# EAGLE design BMP388-Breakout_v10 (EAGLE 7.7.0)
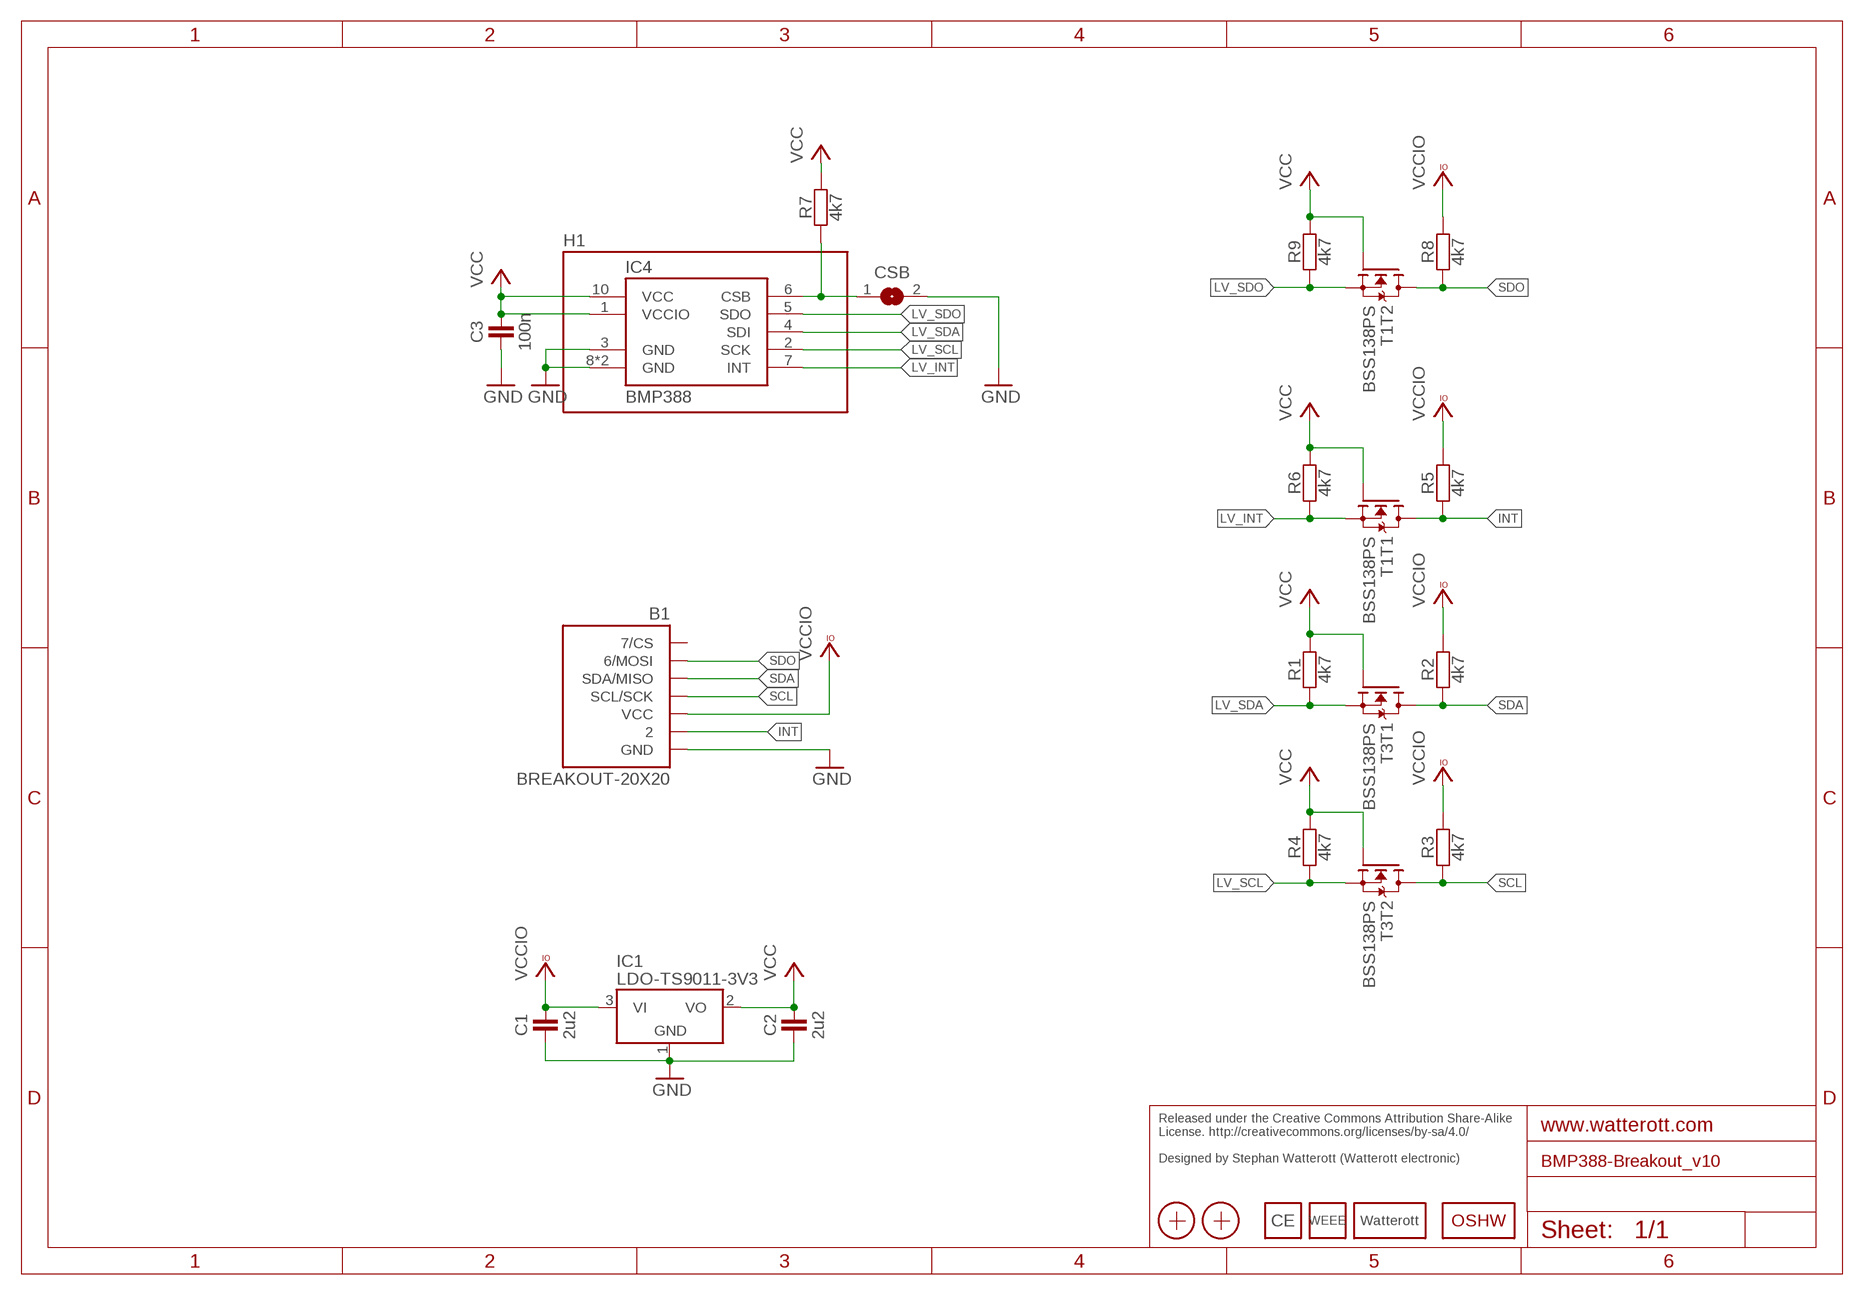
[diagram p0: schematic, sheet 1]

## Parts
B1  BREAKOUT-20X20  [BREAKOUT-20X20]
C1  2u2  CAPACITOR-0402  [C0402]
C2  2u2  CAPACITOR-0402  [C0402]
C3  100n  CAPACITOR-0402  [C0402]
CSB  JUMPER2-0603-NC  [JUMPER2-0603_NC]
H1  SF2  [SF2]
IC1  LDO-TS9011-3V3  [SOT23]
IC4  BMP388  [BMP388]
LOGO2  OSHW_LOGOX0070  [OSHW_6X70]
LOGO3  LOGO_WEEE-4  [WEEE_4MM]
LOGO4  LOGO_CE-4  [CE_4MM]
LOGO5  LOGO_SPARK-4  [SPARK_4MM]
R1  4k7  RESISTOR-0402  [C0402]
R2  4k7  RESISTOR-0402  [C0402]
R3  4k7  RESISTOR-0402  [C0402]
R4  4k7  RESISTOR-0402  [C0402]
R5  4k7  RESISTOR-0402  [C0402]
R6  4k7  RESISTOR-0402  [C0402]
R7  4k7  RESISTOR-0402  [C0402]
R8  4k7  RESISTOR-0402  [C0402]
R9  4k7  RESISTOR-0402  [C0402]
T1  BSS138PS  [SOT363]
T3  BSS138PS  [SOT363]
X1  PASSER-07  [PASSER_07MM]
X2  PASSER-07  [PASSER_07MM]

## Nets
GND: B1.GND C1.1 C2.1 C3.1 CSB.2 IC1.1(GND) IC4.3(GND) IC4.8(GND) IC4.9(GND)
INT: B1.2 R5.1 T1.6(T1:D)
LV_INT: IC4.7(INT) R6.1 T1.1(T1:S)
LV_SCL: IC4.2(SCK) R4.1 T3.4(T2:S)
LV_SDA: IC4.4(SDI) R1.1 T3.1(T1:S)
LV_SDO: IC4.5(SDO) R9.1 T1.4(T2:S)
N$1: CSB.1 IC4.6(CSB) R7.1
SCL: B1.SCL/SCK R3.1 T3.3(T2:D)
SDA: B1.SDA/MISO R2.1 T3.6(T1:D)
SDO: B1.MOSI(6/MOSI) R8.1 T1.3(T2:D)
VCC: C2.2 C3.2 IC1.2(VO) IC4.1(VCCIO) IC4.10(VCC) R1.2 R4.2 R6.2 R7.2 R9.2 T1.2(T1:G) T1.5(T2:G) T3.2(T1:G) T3.5(T2:G)
VCCIO: B1.VCC C1.2 IC1.3(VI) R2.2 R3.2 R5.2 R8.2
Unconnected: B1.CS(7/CS)

## Notes on the sheet
- Released under the Creative Commons Attribution Share-Alike 
  License. http://creativecommons.org/licenses/by-sa/4.0/
  
  Designed by Stephan Watterott (Watterott electronic)

## Library data of the parts
B1 = we-board:BREAKOUT: Breakout Template
C1-C3 = we-rcl:CAPACITOR: Capacitors ...2.2uF @ 6.3V -> 0402 ...4.7uF @ 6.3V -> 0603 ...10uF @ 16V -> 0805 ...22uF @ 25V -> 1206
CSB = we-rcl:JUMPER2: 2-Pin Jumper
H1 = we-sensor:SF2: Sensirion SF2 Filter Cab (Housing for Humidity Sensors)
IC1 = we-power:LDO: LDOs TS1117 800mA, Vin max 12V TS9011 250mA, Vin max 12V - compatible AP2210 300mA, Vin max 15V TS5204 150mA, Vin max 16V
IC4 = we-TESTING:BMP388
LOGO2 = we-symbol:OSHW_LOGO: Open-Source-Hardware Logo
LOGO3 = we-symbol:LOGO_WEEE: WEEE Logo
LOGO4 = we-symbol:LOGO_CE: CE Logo
LOGO5 = we-symbol:LOGO_SPARK: Watterott electronic Logo
R1-R9 = we-rcl:RESISTOR: Resistors all kinds in 0402 and 0603
T1 T3 = we-transistor:BSS138PS: BSS138 Dual N-Channel MOSFET (UGS +/-20V, RDS 1Ohm, ID 320mA)
X1 X2 = we-symbol:PASSER: Fiducial Markers

## Board
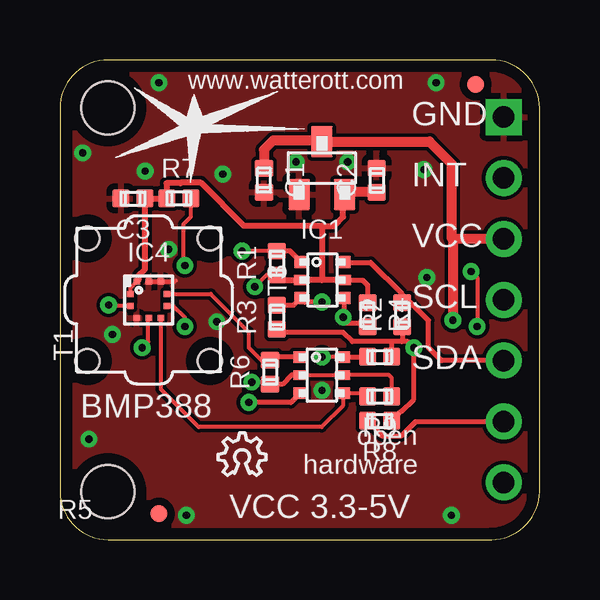
[diagram p1: board, top side]
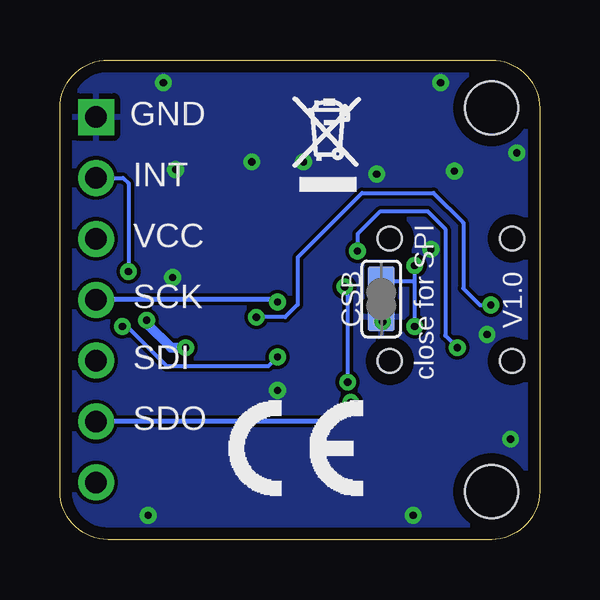
[diagram p2: board, bottom side, seen from below]

Size 20 x 20 mm. Coordinates in mm from the lower left corner, seen from the top.
Copper layers (1*16): Top 0.035mm / dielectric 1.5mm / Bottom 0.035mm
Design rules "we-dru-2-layer": minimum track width 0.15mm, minimum drill 0.3mm, track to track 0.15mm, track to pad 0.15mm, pad to pad 0.15mm, via to via 0.15mm, smd to smd 0.1mm, copper to edge 0.5mm, drill to drill 0.2mm, minimum pad ring 0.18mm, minimum via ring 0.2mm, stop-mask expansion 0.1mm, vias tented up to drill 0.5mm, thermal gap 0.25mm

### Footprints (pad centres in the part's own frame; a part is rotated, then mirrored left to right if it is on the bottom)
BREAKOUT-20X20 = drill 0.9 pad 1.5: 2 18.5,15.08; CS 18.5,2.38; MOSI 18.5,4.92; SCL/SCK 18.5,10; SDA/MISO 18.5,7.46; VCC 18.5,12.54 | drill 0.9 pad 1.5 square: GND 18.5,17.62 | hole 2.2: 2,18; 2,2
C0402 = smd 0.75 x 0.7: 1 0,0.5; 2 0,-0.5
JUMPER2-0603_NC = smd 1.1 x 1.2: 1 0,0.75; 2 0,-0.75
SF2 = hole 1: -2.55,-2.55; 2.55,-2.55; 2.55,2.55; -2.55,2.55
SOT23 = smd 1.3 x 0.9: 1 -1.1,0.95; 2 -1.1,-0.95; 3 1.1,0
BMP388 = smd 0.275 x 0.25: 1 -0.762,0.25; 2 -0.762,-0.25; 3 -0.5,-0.762; 4 0,-0.762; 5 0.5,-0.762; 6 0.762,-0.25; 7 0.762,0.25; 8 0.5,0.762; 9 0,0.762; 10 -0.5,0.762
SOT363 = smd 0.6 x 0.5: 1 -0.9,0.75; 3 -0.9,-0.75; 4 0.9,-0.75; 6 0.9,0.75 | smd 0.6 x 0.4: 2 -0.9,0; 5 0.9,0
PASSER_07MM = smd 0.7 x 0.7: X 0,0

### Placement (x,y rotation side)
B1  0,0 0 top
C1  8.51,14.99 180 top
C2  13.21,14.99 0 top
C3  3.05,14.22 90 top
CSB  6.6,10.03 0 bottom
H1  3.7,10 0 top
IC1  10.92,15.49 90 top
IC4  3.7,10 0 top
LOGO2  6.6,2.67 0 top
LOGO3  8.89,16.51 0 bottom
LOGO4  10.16,3.81 0 bottom
LOGO5  5.59,17.27 0 top
R1  9.04,11.53 0 top
R2  14.27,9.37 0 top
R3  9.04,9.27 0 top
R4  12.83,9.37 180 top
R5  13.34,7.62 90 top
R6  8.76,6.99 0 top
R7  4.95,14.22 270 top
R8  13.34,4.95 90 top
R9  13.34,5.97 90 top
T1  10.92,6.86 0 top
T3  10.95,10.82 0 top
X1  17.34,18.99 0 top
X2  4.13,1.08 0 top

### Tracks (layer width: path | path; a pad name or v marks a point on that pad's centre or on a via)
GND  (via drill 0.3)
  Top 0.16: IC4.9 4.79,10.76 4.83,10.79
  other vias: 3.56,15.37 2.18,8.55 6.79,15.24 15.18,15.43 9.84,15.75 1.21,4.19 0.95,16.13 16.32,1.02 4.13,19.05 6.54,9.08 4.53,12.1 5.27,1.02 15.68,19.05 12,15.75 15.3,10.92 10.92,6.22
  pour Top: -0.13,19.94 20.13,19.94 20.13,-0.13 -0.13,-0.13
  pour Bottom: -0.13,19.94 20.13,19.94 20.13,-0.13 -0.13,-0.13
INT  (via drill 0.3)
  Top 0.16: T1.6 11.06,7.61 11.05,7.62 v10.92,7.62 | v17.14,11.18 17.4,10.92 v17.4,8.89
  Top 0.2: T1.6 12.82,7.61 R5.1 12.83,7.61
  Bottom 0.16: B1.2 17.37,15.08 17.14,14.86 v17.14,11.18 | v10.92,7.62 11.3,7.24 15.55,7.24 17.2,8.89 v17.4,8.89
LV_INT
  Top 0.16: IC4.7 6.29,10.25 7.87,8.66 7.87,8 8.39,7.49 R6.1
  Top 0.2: T1.1 8.89,7.61 R6.1
LV_SCL  (via drill 0.3)
  Top 0.16: IC4.2 2.19,9.75 2.16,9.78 v2.03,9.78
  Top 0.2: 11.85,9.27 v11.81,9.27 | T3.4 11.85,9.27 | 11.85,9.27 11.85,9.02 12.68,9.02 R4.1
  Bottom 0.16: v11.81,9.27 10.61,9.27 10.09,9.79 10.09,11.76 7.4,14.45 4.42,14.45 3.18,13.21 3.18,10.48 2.48,9.78 v2.03,9.78
LV_SDA  (via drill 0.3)
  Top 0.16: IC4.4 3.68,9.22 3.68,8.26 v3.43,8 | R1.1 7.71,12.03 7.62,11.94 7.62,12.01 v7.6,12.03
  Top 0.2: T3.1 9.59,12.03 R1.1
  Bottom 0.16: v7.6,12.03 7.58,12.03 7.58,12.74 6.63,13.69 4.68,13.69 3.94,12.95 3.94,8.51 v3.43,8
LV_SDO
  Top 0.16: IC4.5 4.2,6.28 5.79,4.69 10.91,4.69 11.82,5.6 T1.4 11.83,6.1 | R9.1 12.71,6.1 11.83,6.1 | 11.83,6.1 11.82,6.1
N$1  (via drill 0.3)
  Top 0.16: IC4.6 4.73,9.75 5.21,9.27 v5.21,8.89 | v5.21,11.43 5.14,11.49 5.14,13.14 5.46,13.46 5.46,14.22 R7.1
  Bottom 0.16: v5.21,8.89 5.21,10.79 | 5.21,10.79 v5.21,11.43 | CSB.1 5.22,10.78 5.21,10.79
SCL  (via drill 0.3)
  Top 0.2: 9.02,9.92 9.02,9.91 9.04,9.88 R3.1 9.75,9.77 T3.3 10.21,9.91 v10.92,9.91
  Bottom 0.2: B1.SCL/SCK 18.47,10.03 11,10.03 10.92,9.96 v10.92,9.91 10.79,9.91
SDA
  Top 0.2: 18.47,7.49 B1.SDA/MISO 15.91,7.46 15.37,8 15.37,9.14 14.64,9.87 R2.1 14.28,10.24 12.95,11.56 11.86,11.56 T3.6
SDO  (via drill 0.3)
  Top 0.2: T1.3 9.63,5.71 v7.87,5.71 | B1.MOSI 14.84,4.92 14.25,4.33 13.42,4.33 13.23,4.51 13.23,4.55 R8.1
  Bottom 0.2: v7.87,5.71 8.67,4.92 B1.MOSI
VCC  (via drill 0.3)
  Top 0.16: IC4.1 2.94,10.5 IC4.10 | R9.2 13.84,6.74 13.72,6.86 T1.5 T1.2 | R1.2 8.62,11.03 v8.13,10.54 | v8,6.57 8.68,6.57 R6.2
  Top 0.2: T3.5 12.62,10.82 12.83,10.62 R4.2 | T1.2 9.65,6.86 9.27,6.48 8.77,6.48 R6.2
  Top 0.254: T3.5 10.92,10.82 | 10.92,10.82 T3.2 9.1,10.82 R1.2 | 11.8,14.34 IC1.2 11.81,14.33 11.81,13.46 11.43,13.08 10.92,13.08 | 10.92,13.08 10.92,10.82 | 10.92,13.08 7.67,13.08 5.88,14.88 5.03,14.88 5.01,14.86 4.45,14.86 4.45,14.85 R7.2 C3.2 3.55,11.27 3.29,11 3.29,10.85 IC4.10
  Top 0.406: C2.2 11.87,14.49 IC1.2
  Bottom 0.16: v8.13,10.54 8,10.41 v8,6.57 8,6.48
VCCIO  (via drill 0.3)
  Top 0.16: 16.38,12.54 16.35,12.54
  Top 0.2: 13.84,8.26 12.19,8.26 11.81,8.64 9.18,8.64 R3.2 | R2.2 14.28,8.28 14.25,8.26 | R5.2 13.84,8.25 13.84,8.26 | R8.2 14.23,5.34 14.25,5.34 14.76,5.85 v14.76,8 14.5,8.26 14.25,8.26 | 14.25,8.26 13.84,8.26
  Top 0.406: C1.2 8.51,16.26 8.89,16.64 10.62,16.64 IC1.3 15.41,16.59 16.35,15.65 16.35,12.54 | v16.38,9.14 16.38,12.54 B1.VCC
  Bottom 0.2: 14.86,7.9 v14.76,8
  Bottom 0.406: v14.76,8 15.37,8 16.38,9.02 v16.38,9.14

### Text on the board
tPlace: www.watterott.com | GND | INT | VCC | SCL | SDA | BMP388 | open / hardware | VCC 3.3-5V
bPlace: GND | INT | VCC | V1.0 | close for SPI | SCK | SDI | SDO